# Altium schematic sheet S3220A5.SchDoc: External board with EPD and RGB sensor
size A3; Revision: A; SheetNumber: 5; SheetTotal: 5
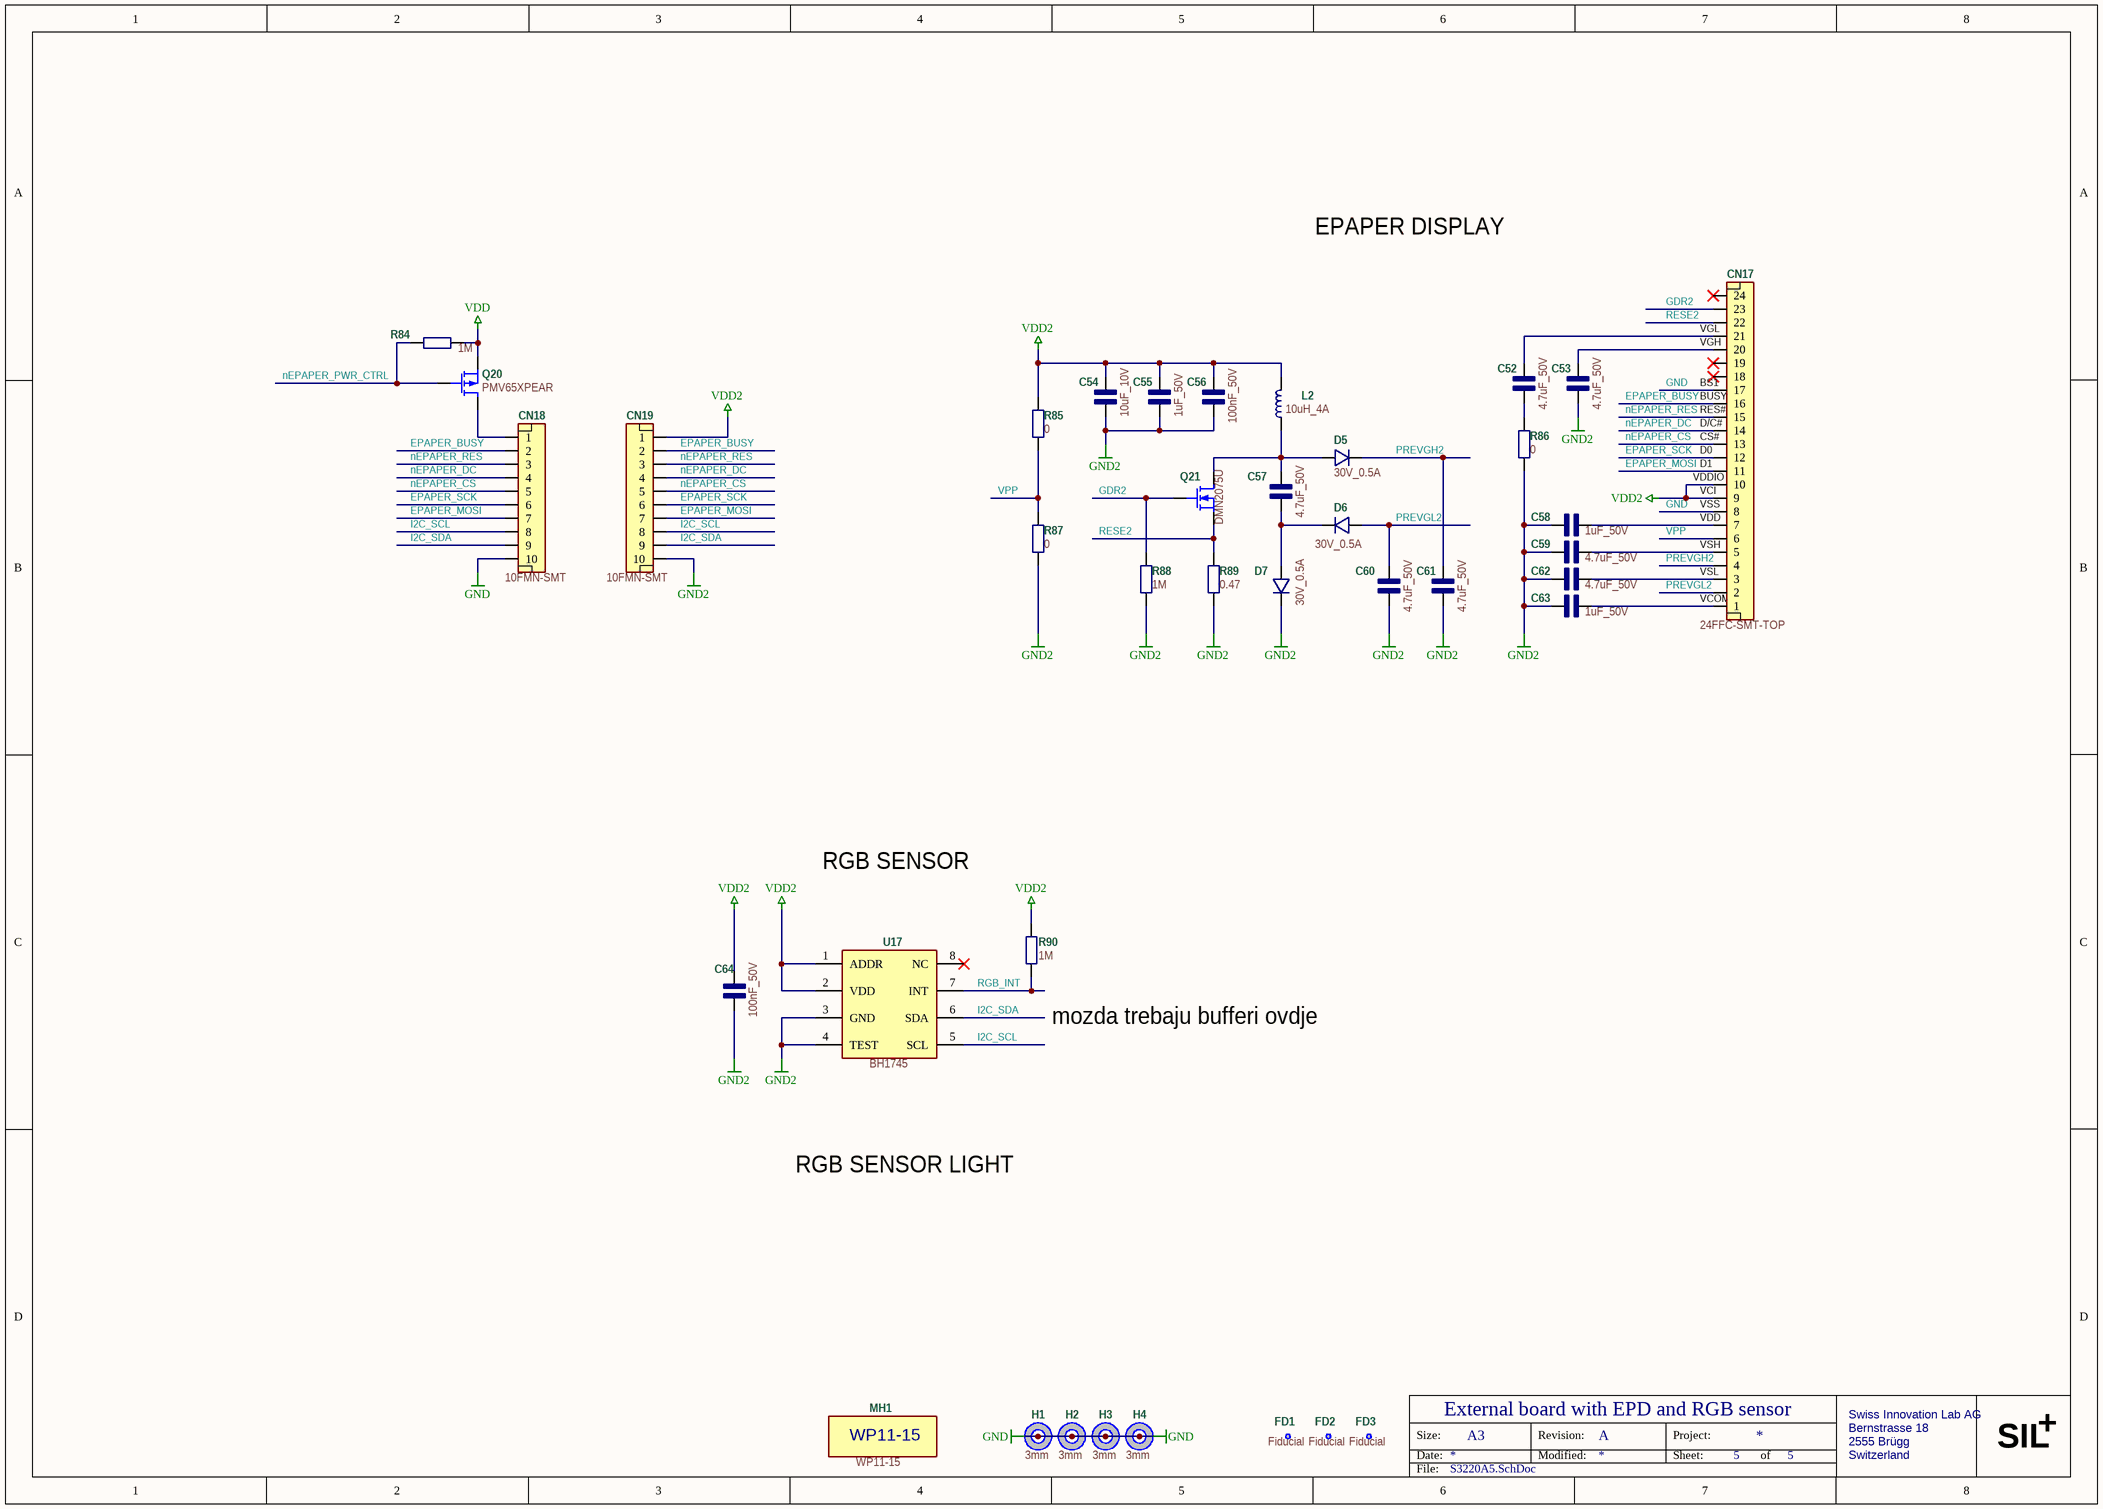
[diagram p0: S3220A5.SchDoc]

## Parts
C52  4.7uF_50V  [C_1210]
C53  4.7uF_50V  [C_1210]
C54  10uF_10V  [C_0603]
C55  1uF_50V  [C_0603]
C56  100nF_50V  [C_0603]
C57  4.7uF_50V  [C_1210]
C58  1uF_50V  [C_0603]
C59  4.7uF_50V  [C_1210]
C60  4.7uF_50V  [C_1210]
C61  4.7uF_50V  [C_1210]
C62  4.7uF_50V  [C_1210]
C63  1uF_50V  [C_0603]
C64  100nF_50V  [C_0603]
CN17  24FFC-SMT-TOP  [CN_FFC-24-SMT-TOP]
CN18  10FMN-SMT  [CN_FCC-10FMN-SMT]
CN19  10FMN-SMT  [CN_FCC-10FMN-SMT]
D5  30V_0.5A  [D_SOD-123]
D6  30V_0.5A  [D_SOD-123]
D7  30V_0.5A  [D_SOD-123]
FD1  Fiducial  [FD_Fiducial]  (no BOM)
FD2  Fiducial  [FD_Fiducial]  (no BOM)
FD3  Fiducial  [FD_Fiducial]  (no BOM)
H1  3mm  [H_3M_55M]  (no BOM)
H2  3mm  [H_3M_55M]  (no BOM)
H3  3mm  [H_3M_55M]  (no BOM)
H4  3mm  [H_3M_55M]  (no BOM)
L2  10uH_4A  [L_SRP6540]
MH1  WP11-15  [MH_WP11-15]  (no BOM)
Q20  PMV65XPEAR  [Q_SOT23]
Q21  DMN2075U  [Q_SOT23]
R84  1M  [R_0603]
R85  0  [R_0603]
R86  0  [R_0603]
R87  0  [R_0603]
R88  1M  [R_0603]
R89  0.47  [R_0603]
R90  1M  [R_0603]
U17  BH1745  [U_8-WSON_2120]

## Nets
GND: CN17.8 CN17.17 CN18.10 H1.0 H2.0 H3.0 H4.0
GND2: C53.1 C54.1 C55.1 C56.1 C58.1 C59.2 C60.1 C61.1 C62.2 C63.1 C64.2 CN19.10 D7.K R86.1 R87.2 R88.1 R89.1 U17.3(GND) U17.4(TEST)
VDD: Q20.2(S) R84.2
VDD2: C54.2 C55.2 C56.2 C64.1 CN17.9 CN17.10 CN19.1 L2.2 R85.2 R90.1 U17.1(ADDR) U17.2(VDD)
EPAPER_BUSY: CN17.16 CN18.2 CN19.2
EPAPER_MOSI: CN17.11 CN18.7 CN19.7
EPAPER_SCK: CN17.12 CN18.6 CN19.6
GDR2: CN17.23 Q21.1(G) R88.2
I2C_SCL: CN18.8 CN19.8 U17.5(SCL)
I2C_SDA: CN18.9 CN19.9 U17.6(SDA)
nEPAPER_CS: CN17.13 CN18.5 CN19.5
nEPAPER_DC: CN17.14 CN18.4 CN19.4
nEPAPER_PWR_CTRL: Q20.1(G) R84.1
nEPAPER_RES: CN17.15 CN18.3 CN19.3
PREVGH2: C61.2 CN17.4 D5.K
PREVGL2: C60.2 CN17.2 D6.A
RESE2: CN17.22 Q21.2(S) R89.2
RGB_INT: R90.2 U17.7(INT)
VPP: CN17.6 R85.1 R87.1
NetC52_1: C52.1 R86.2
NetC52_2: C52.2 CN17.21
NetC53_2: C53.2 CN17.20
NetC57_1: C57.1 D6.K D7.A
NetC57_2: C57.2 D5.A L2.1 Q21.3(D)
NetC58_2: C58.2 CN17.7
NetC59_1: C59.1 CN17.5
NetC62_1: C62.1 CN17.3
NetC63_2: C63.2 CN17.1
NetCN18_1: CN18.1 Q20.3(D)

Not connected (* = marked no-connect by the designer): CN17 18* 19* 24*; FD1 0; FD2 0; FD3 0; MH1 0; U17 8(NC)*

## Notes on the sheet
- EPAPER DISPLAY
- (near CN17) VGL
- (near CN17) VGH
- (near CN17) D/C#
- (near CN17) RES#
- (near CN17) BUSY
- (near CN17) CS#
- (near CN17) D0
- (near CN17) BS1
- (near CN17) VDDIO
- (near CN17) VCI
- (near CN17) VSS
- (near CN17) D1
- (near CN17) VSL
- (near CN17) VSH
- (near CN17) VDD
- (near CN17) VCOM
- RGB SENSOR
- (near R90) mozda trebaju bufferi ovdje
- RGB SENSOR LIGHT
- Size:
- Date:
- A3
- Revision:
- Modified:
- Project:
- Sheet:
- of
- Swiss Innovation Lab AG
- Bernstrasse 18
- 2555 Brügg
- Switzerland
- SIL
- +
- File:

## Library data of the parts
C52 C53 C57 C59-C62 = C_4.7uF_50V: 4.7µF 50V Ceramic Capacitor X7R 1210 (3225 Metric) 0.126" L x 0.098" W (3.20mm x 2.50mm); Manufacturer: Taiyo Yuden; Manufacturer Part Number: UMK325B7475MM-T; Value: 4.7uF; ValueAux: _50V; Currency: $; Price: 0,26980; Supplier 1: Digi-Key; Supplier Part Number 1: 587-2785-1-ND
C54 = C_10uF_10V: 10µF ±10% 10V Ceramic Capacitor X5R 0603 (1608 Metric); Manufacturer: Murata Electronics North America; Manufacturer Part Number: GRM188R61A106KE69D; Value: 10uF; ValueAux: _10V; Currency: $; Price: 0,03994; Supplier 1: Digi-Key; Supplier Part Number 1: 490-10474-1-ND
C55 C58 C63 = C_1uF_50V: 1µF 50V Ceramic Capacitor X5R 0603 (1608 Metric) 0.063" L x 0.032" W (1.60mm x 0.80mm); Manufacturer: Samsung Electro-Mechanics; Manufacturer Part Number: CL10A105KB8NNNC; Value: 1uF; ValueAux: _50V; Currency: $; Price: 0,03472; Supplier 1: Digi-Key; Supplier Part Number 1: 1276-1860-1-ND
C56 C64 = C_100nF_50V: 0.1µF ±10% 50V Ceramic Capacitor X7R 0603 (1608 Metric); Manufacturer: TDK; Manufacturer Part Number: C1608X7R1H104K080AA; Value: 100nF; ValueAux: _50V; Currency: $; Price: 0,01309; Supplier 1: Digi-Key; Supplier Part Number 1: 445-1314-6-ND
CN17 = CN_24FFC-SMT-TOP: 24 Position FFC, FPC Connector Contacts, Top 0.020" (0.50mm) Surface Mount, Right Angle; Manufacturer: Amphenol FCI; Manufacturer Part Number: SFV24R-2STE1HLF; Currency: $; Supplier 1: Digi-Key; Supplier Part Number 1: 609-4321-1-ND; Value: 24FFC-SMT-TOP; Price: 0,54771
CN18 CN19 = CN_10FMN-SMT: 10 Position FFC Connector Contacts, Top 0.039" (1.00mm) Surface Mount, Right Angle; Manufacturer: JST Sales America Inc.; Manufacturer Part Number: 10FMN-SMT-A-TF(LF)(SN); Currency: $; Supplier 1: Digi-Key; Supplier Part Number 1: 455-1934-1-ND; Value: 10FMN-SMT; Price: 0,36161
D5-D7 = D_30V_0.5A: Diode Schottky 30V 500mA Surface Mount SOD-123; Manufacturer: ON Semiconductor; Manufacturer Part Number: MBR0530; ValueAux: _0.5A; Currency: $; Value: 30V; Price: 0,08607; Supplier 1: Digi-Key; Supplier Part Number 1: MBR0530CT-ND
FD1-FD3 = FD_Fiducial: Reference point for assembly machine; Manufacturer: Swiss Innovation Lab; Currency: $; Value: Fiducial; Manufacturer Part Number: Fiducial; Price: 0; Supplier 1: Swiss Innovation Lab; Supplier Part Number 1: Fiducial
H1-H4 = H_3M_55M: Hole 3mm, Pad 5.5mm; Manufacturer: Swissinnolab; Currency: $; Value: 3mm; Price: 0
L2 = L_10uH_4A: 10µH Shielded Wirewound Inductor 4A 78.5 mOhm Max Nonstandard; Manufacturer: Bourns Inc.; Manufacturer Part Number: SRP6540-100M; Value: 10uH; ValueAux: _4A; Currency: $; Price: 0,68932; Supplier 1: Digi-Key; Supplier Part Number 1: SRP6540-100MCT-ND
MH1 = MH_WP11-15: Case Takachi WP11-15; Currency: $; Value: WP11-15; Manufacturer: Takachi; Manufacturer Part Number: WP11-15; Price: 0
Q20 = Q_PMV65: P-Channel 20V 2.8A (Ta) 480mW (Ta), 6.25W (Tc) Surface Mount TO-236AB (SOT23); Manufacturer: Nexperia USA Inc.; Currency: $; Value: PMV65XPEAR; Manufacturer Part Number: PMV65XPEAR; Price: 0,11204; Supplier 1: Digi-Key; Supplier Part Number 1: 1727-2310-1-ND
Q21 = Q_DMN2075U: N-Channel 20V 4.2A (Ta) 800mW (Ta) Surface Mount SOT-23-3; Manufacturer: Diodes Incorporated; Manufacturer Part Number: DMN2075U-7; Currency: $; Value: DMN2075U; Price: 0,09535; Supplier 1: Digi-Key; Supplier Part Number 1: DMN2075U-7DICT-ND
R84 R88 R90 = R_1M_1%: 1 MOhms ±1% 0.1W, 1/10W Chip Resistor 0603 (1608 Metric) Automotive AEC-Q200 Thick Film; Manufacturer: Panasonic Electronic Components; Manufacturer Part Number: ERJ-3EKF1004V; Currency: $; Value: 1M; Price: 0,01264; Supplier 1: Digi-Key; Supplier Part Number 1: P1.00MHCT-ND
R85-R87 = R_0_1%: 0 Ohms Jumper 0.1W, 1/10W Chip Resistor 0603 (1608 Metric) Automotive AEC-Q200 Thick Film; Manufacturer: Panasonic Electronic Components; Manufacturer Part Number: ERJ-3GEY0R00V; Currency: $; Value: 0; Price: 0,00962; Supplier 1: Digi-Key; Supplier Part Number 1: P0.0GCT-ND
R89 = R_0.47_1%: 470 mOhms ±1% 0.25W, 1/4W Chip Resistor 0603 (1608 Metric) Automotive AEC-Q200, Current Sense Thick Film; Manufacturer: Panasonic Electronic Components; Manufacturer Part Number: ERJ-3BQFR47V; Currency: $; Value: 0.47; Price: 0,05532; Supplier 1: Digi-Key; Supplier Part Number 1: P17400CT-ND
U17 = U_BH1745: Color Sensor  Standby 8-UDFN Exposed Pad; Manufacturer: Rohm Semiconductor; Manufacturer Part Number: BH1745NUC-E2; Currency: $; Value: BH1745; Price: 0,90365; Supplier 1: Digi-Key; Supplier Part Number 1: BH1745NUC-E2CT-ND